# Altium schematic sheet pulseox.SchDoc
size A
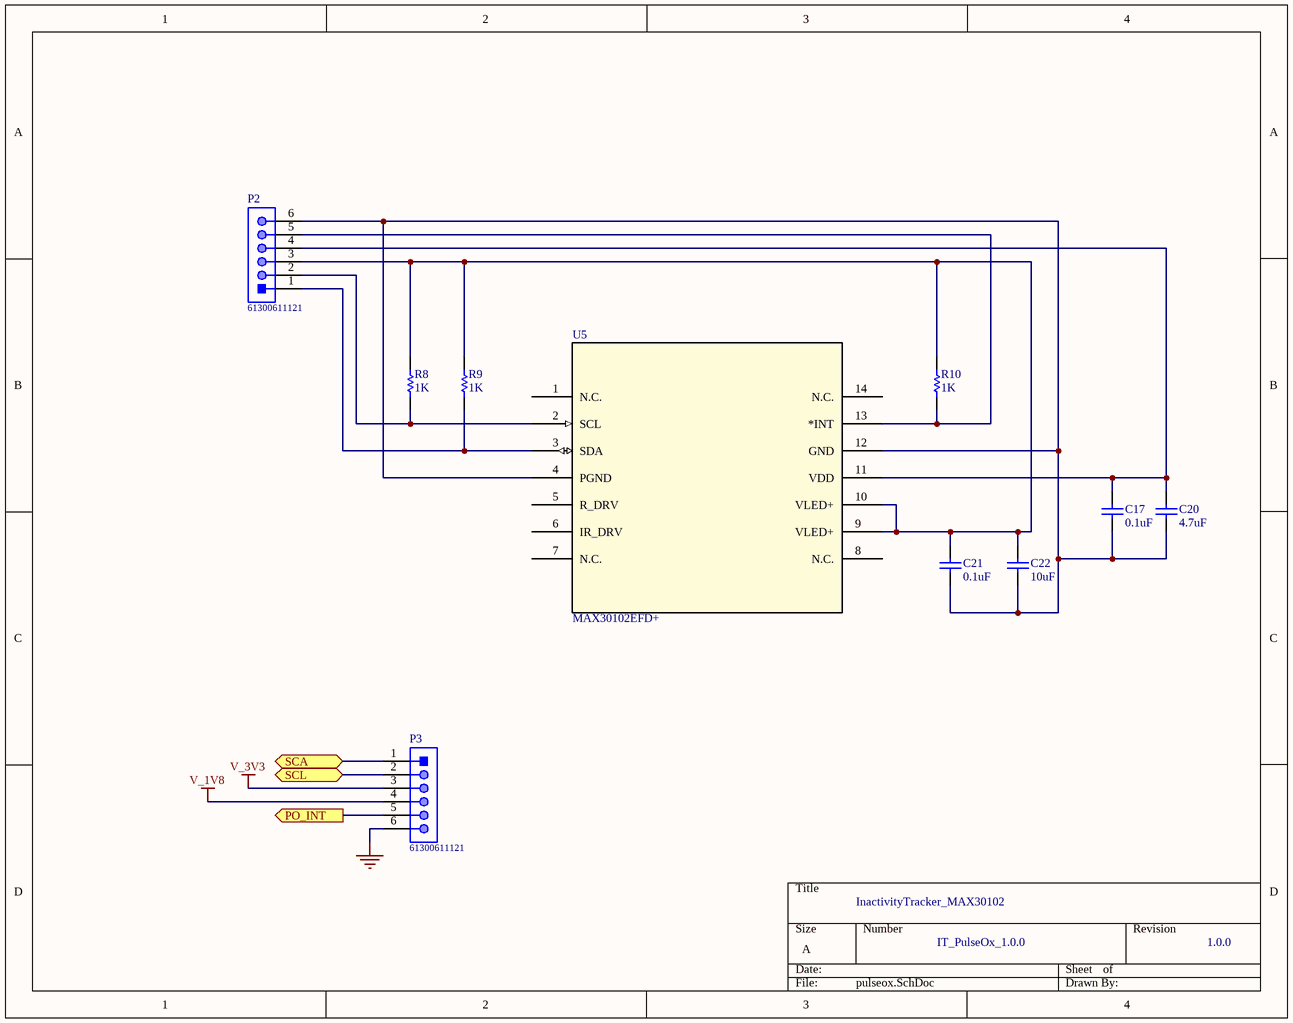
[diagram p0: pulseox.SchDoc]

## Parts
C17  0.1uF  [CAPC1005X55X25ML05T10]
C20  4.7uF  [CAPC1005X55X25NL05T10]
C21  0.1uF  [CAPC1005X55X25ML05T10]
C22  10uF  [CAPC1608X90X35NL10T15]
P2  61300611121  [61300611121]
P3  61300611121  [61300611121]
R8  1K  [RESC1005X40X25NL05T05]
R9  1K  [RESC1005X40X25NL05T05]
R10  1K  [RESC1005X40X25NL05T05]
U5  MAX30102EFD+  [21-0880B-L]

## Ports
PO_INT (out), SCA (bidir), SCL (bidir)

## Nets
GND: P3.6
V_1V8: P3.4
V_3V3: P3.3
PO_INT: P3.5 ; port PO_INT
SCA: P3.1 ; port SCA
SCL: P3.2 ; port SCL
NetC17_1: C17.1 C20.1 P2.4 U5.11(VDD)
NetC17_2: C17.2 C20.2 C21.2 C22.2 P2.6 U5.4(PGND) U5.12(GND)
NetC21_1: C21.1 C22.1 P2.3 R8.2 R9.2 R10.1 U5.9(VLED+) U5.10(VLED+)
NetP2_1: P2.1 R9.1 U5.3(SDA)
NetP2_2: P2.2 R8.1 U5.2(SCL)
NetP2_5: P2.5 R10.2 U5.13(*INT)

Not connected (* = marked no-connect by the designer): U5 1(N.C.) 5(R_DRV) 6(IR_DRV) 7(N.C.) 8(N.C.) 14(N.C.)

## Notes on the sheet
- InactivityTracker_MAX30102
- IT_PulseOx_1.0.0
- 1.0.0

## Library data of the parts
C17 C21 = CMP-2100-03641-1: Chip Capacitor, 0.1 uF, +/- 10%, 16 V, -55 to 125 degC, 0402 (1005 Metric), RoHS, Tape and Reel; Manufacturer: Murata; Material: Ceramic; Insulation Resistance: 10GR; Voltage: 16V; Dielectric: X7R; Capacitance: 100nF; REACH SVHC: NoSVHC; Depth: 0.5mm; Case/Package: 0402; Datasheet URL: http://psearch.en.murata.com/capacitor/product/GRM155R71C104KA88%23.pdf; Lead Free: LeadFree; Dielectric Material: Ceramic; Manufacturer URL: http://www.murata.com/; Min Operating Temperature: -55degC; Length: 1mm; Case Code (Metric): 1005; Radiation Hardening: No; Package Reference: 0402; RoHSCompliant: true; Datasheet Version: 42675.0; Thickness: 0.022inch; Packaging: TapeandReel; Voltage Rating (DC): 16V; Tolerance: 10%; Max Operating Temperature: 125degC; Package Description: 2-Pin Surface Mount Device, Body 1 x 0.5 mm; Mount: SurfaceMount; Height: 0.5mm; Width: 0.5mm; Number of Pins: 2; Voltage Rating: 16V; Case Code (Imperial): 0402; Termination: SMD/SMT; Package Quantity: 1
C20 = CMP-2008-04549-1: Part Number: GRM155R60J475ME47D; Manufacturer: Murata
C22 = CMP-2006-02792-1: Part Number: GRM188R60J106ME47D; Manufacturer: Murata
P2 P3 = CMP-1502-01070-1: THT Vertical Pin Header WR-PHD, Pitch 2.54 mm, Single Row, 6 pins; Manufacturer: Wurth Elektronik; Gender: Male; Pin Number: 6; Pitch: 2.54mm; Working Voltage: 250VAC; Rated Current: 3A; Withstanding Voltage: 500VAC; Contact Resistance: 20mOhm; Operating Temperature: -40to105degC; Packaging: Bag; Datasheet URL: https://katalog.we-online.de/em/datasheet/6130xx11121.pdf; Package Reference: 61300611121; Mounting Technology: THT; Publisher: WurthElektronik; Part Number: 61300611121; Manufacturer URL: http://www.we-online.de; Row Number: Single; Orientation: Vertical
R8-R10 = CMP-2002-08276-1: Manufacturer: Vishay Dale; Part Number: CRCW04021K00FKED
U5 = MAX30102EFD+: IC SENSOR OXIMETER/HEARTRATE; Manufacturer: Maxim; Min Supply Voltage: 1.7V; Max Supply Voltage: 2V; Supplier 1: Digi-Key; Manufacturer Part Number: MAX30102EFD+; RoHS: Yes; Category: Decoders, Multiplexers; Stock 1: 798; Pricing 1: 1=9.76000, 10=8.81500, 25=8.40520, 100=7.29800, 500=6.35500, 1000=5.53500 (USD); Number of Pins: 14; Min Operating Temperature: -40°C; Max Operating Temperature: 85°C; REACH SVHC: No SVHC; ComponentLink1URL: http://www.farnell.com/datasheets/2162814.pdf?src-supplier=Farnell; ComponentLink1Description: http://www.farnell.com/datasheets/2162814.pdf?src-supplier=Farnell; ComponentLink2URL: http://www.farnell.com/datasheets/2162814.pdf?src-supplier=Element14; ComponentLink2Description: http://www.farnell.com/datasheets/2162814.pdf?src-supplier=Element14; ComponentLink3URL: https://datasheets.maximintegrated.com/en/ds/MAX30102.pdf?src-supplier=Digi-Key; ComponentLink3Description: https://datasheets.maximintegrated.com/en/ds/MAX30102.pdf?src-supplier=Digi-Key; Supplier Part Number 1: MAX30102EFD+-ND